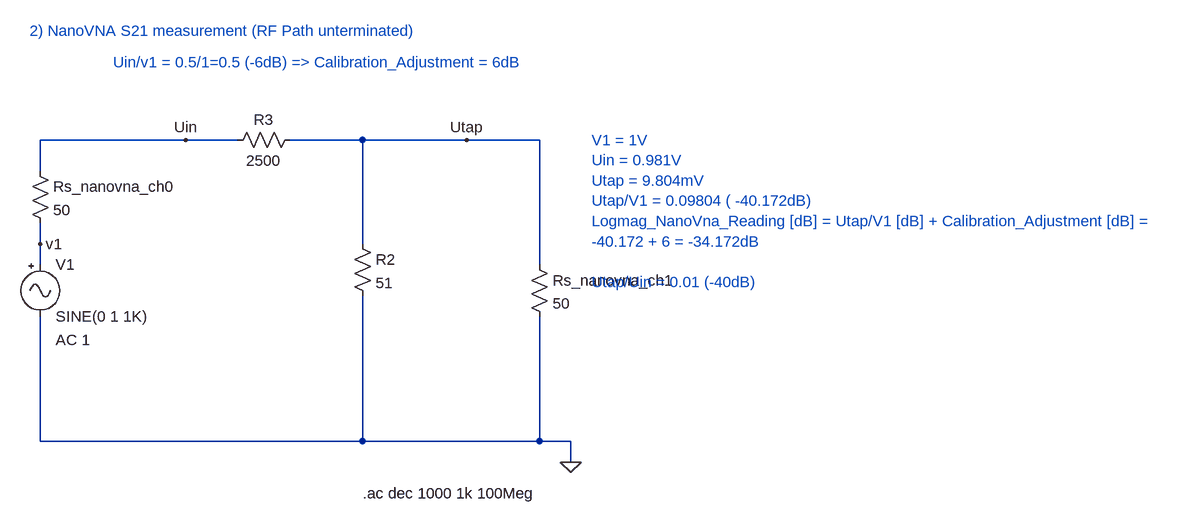
[diagram p0: schematic RFTap_v1_unterminated_RF_Path.asc]
RFTap_v1_unterminated_RF_Path.asc, the LTspice schematic file:
Version 4
SHEET 1 1764 1784
WIRE -3216 368 -3440 368
WIRE -3136 368 -3216 368
WIRE -2944 368 -3056 368
WIRE -2784 368 -2944 368
WIRE -2672 368 -2784 368
WIRE -3440 416 -3440 368
WIRE -3440 528 -3440 496
WIRE -2944 528 -2944 368
WIRE -3440 560 -3440 528
WIRE -2672 560 -2672 368
WIRE -3440 832 -3440 640
WIRE -2944 832 -2944 608
WIRE -2944 832 -3440 832
WIRE -2672 832 -2672 640
WIRE -2672 832 -2944 832
WIRE -2624 832 -2672 832
WIRE -2624 864 -2624 832
FLAG -2624 864 0
FLAG -3440 528 v1
FLAG -3216 368 Uin
FLAG -2784 368 Utap
SYMBOL Misc\\signal -3440 544 R0
WINDOW 123 24 132 Left 2
WINDOW 39 24 160 Left 2
SYMATTR Value2 AC 1
SYMATTR InstName V1
SYMBOL res -2688 544 R0
SYMATTR InstName Rs_nanovna_ch1
SYMATTR Value 50
SYMBOL res -3456 400 R0
SYMATTR InstName Rs_nanovna_ch0
SYMATTR Value 50
SYMBOL res -2960 512 R0
SYMATTR InstName R2
SYMATTR Value 51
SYMBOL res -3040 352 R90
WINDOW 0 0 56 VBottom 2
WINDOW 3 32 56 VTop 2
SYMATTR InstName R3
SYMATTR Value 2500
TEXT -2944 912 Left 2 !.ac dec 1000 1k 100Meg
TEXT -3456 200 Left 2 ;2) NanoVNA S21 measurement (RF Path unterminated)
TEXT -3328 248 Left 2 ;Uin/v1 = 0.5/1=0.5 (-6dB) => Calibration_Adjustment = 6dB
TEXT -2592 368 Left 2 ;V1 = 1V\nUin = 0.981V\nUtap = 9.804mV\nUtap/V1 = 0.09804 ( -40.172dB)\nLogmag_NanoVna_Reading [dB] = Utap/V1 [dB] + Calibration_Adjustment [dB] = \n-40.172 + 6 = -34.172dB\n \nUtap/Uin = 0.01 (-40dB)

The netlist it stands for:
* RFTap_v1_unterminated_RF_Path.asc
V1 v1 0 SINE(0 1 1K) AC 1
Rs_nanovna_ch1 Utap 0 50
Rs_nanovna_ch0 Uin v1 50
R2 Utap 0 51
R3 Utap Uin 2500
.ac dec 1000 1k 100Meg
* 2) NanoVNA S21 measurement (RF Path unterminated)
* Uin/v1 = 0.5/1=0.5 (-6dB) => Calibration_Adjustment = 6dB
* V1 = 1V
* Uin = 0.981V
* Utap = 9.804mV
* Utap/V1 = 0.09804 ( -40.172dB)
* Logmag_NanoVna_Reading [dB] = Utap/V1 [dB] + Calibration_Adjustment [dB] =
* -40.172 + 6 = -34.172dB
* Utap/Uin = 0.01 (-40dB)
.backanno
.end